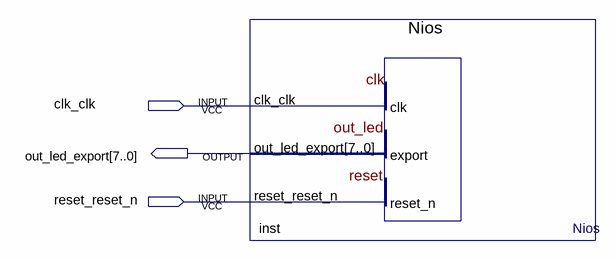
[diagram p0: schematic sheet]
// Quartus schematic Nios_logic.bdf as structural Verilog: 1 symbols, 3 pins
module Nios_logic (
  input  clk_clk,
  input  reset_reset_n,
  output [7:0] out_led_export
);

  Nios inst (.clk_clk(clk_clk), .reset_reset_n(reset_reset_n), .out_led_export(out_led_export));
endmodule
